# Altium schematic sheet DC_Power_Regulation.SchDoc
size A; SheetNumber: 1; SheetTotal: 2
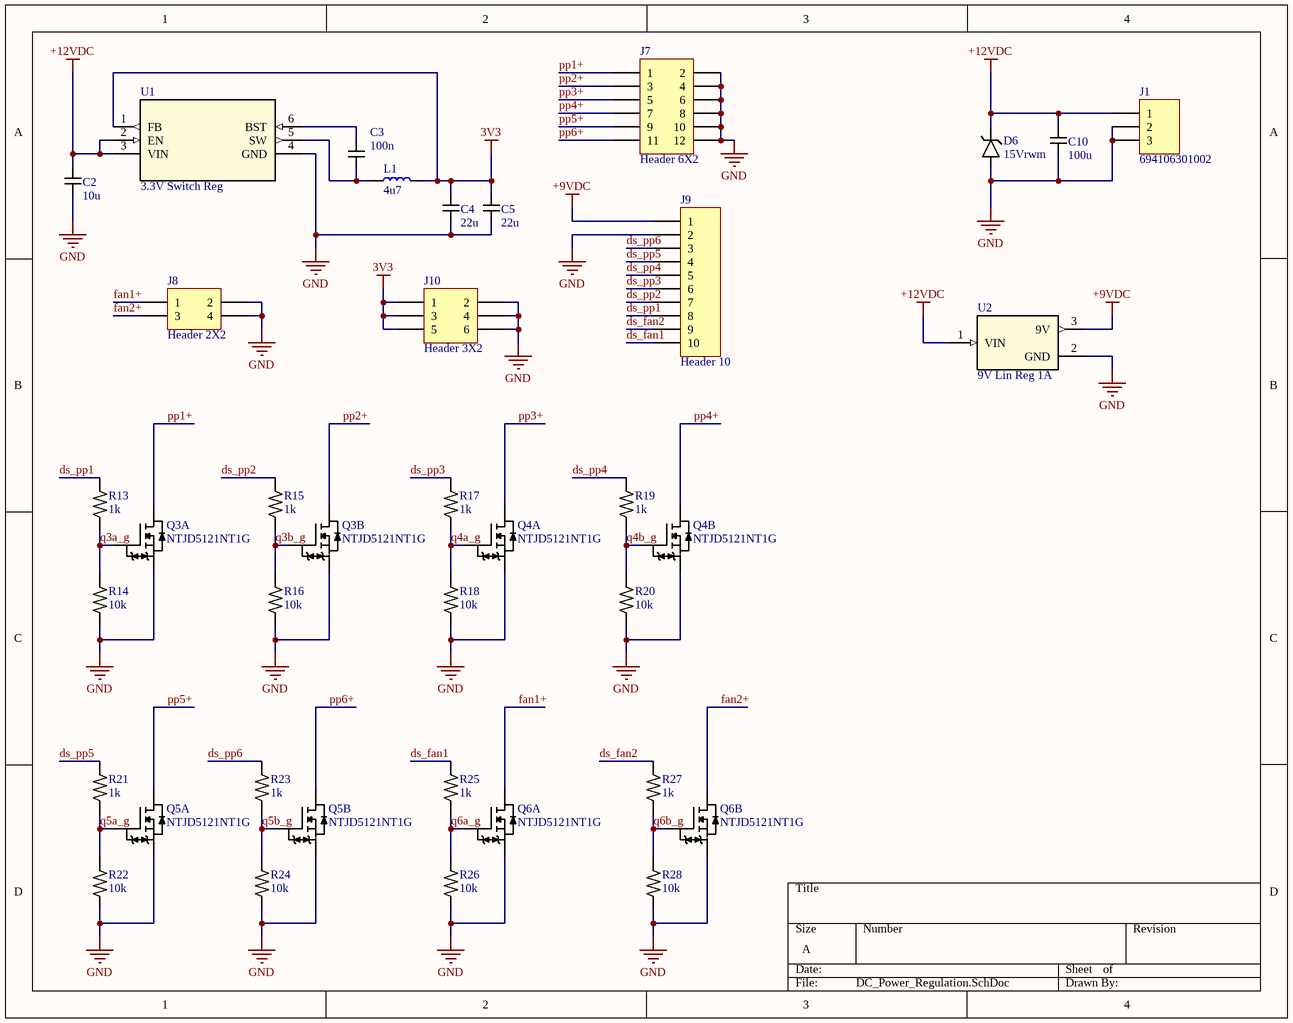
[diagram p0: DC_Power_Regulation.SchDoc]

## Parts
C2  10u  [CAP_0805]
C3  100n  [CAP_0402]
C4  22u  [CAP_0805]
C5  22u  [CAP_0805]
C10  100u  [CAP_EEH-ZA1V151P_PAN]
D6  15Vrwm  [SOD523]
J1  694106301002  [694106301002]
J7  Header 6X2  [HDR2X6]
J8  Header 2X2  [HDR2X2]
J9  Header 10  [HDR1X10]
J10  Header 3X2  [HDR2X3]
L1  4u7  [IND_0603]
Q3  NTJD5121NT1G  [SOT-363]  (parts A,B of 2)
Q4  NTJD5121NT1G  [SOT-363]  (parts A,B of 2)
Q5  NTJD5121NT1G  [SOT-363]  (parts A,B of 2)
Q6  NTJD5121NT1G  [SOT-363]  (parts A,B of 2)
R13  1k  [RES_0402]
R14  10k  [RES_0402]
R15  1k  [RES_0402]
R16  10k  [RES_0402]
R17  1k  [RES_0402]
R18  10k  [RES_0402]
R19  1k  [RES_0402]
R20  10k  [RES_0402]
R21  1k  [RES_0402]
R22  10k  [RES_0402]
R23  1k  [RES_0402]
R24  10k  [RES_0402]
R25  1k  [RES_0402]
R26  10k  [RES_0402]
R27  1k  [RES_0402]
R28  10k  [RES_0402]
U1  3.3V Switch Reg  [AP63203WU-7]
U2  9V Lin Reg 1A  [MC7809CTG]

## Nets
3V3: C4.2 C5.2 J10.1 J10.3 J10.5 L1.2 U1.1(FB)
+9VDC: J9.1 U2.3(9V)
+12VDC: C2.2 C10.2 D6.1(V++) J1.1 U1.2(EN) U1.3(VIN) U2.1(VIN)
GND: C2.1 C4.1 C5.1 C10.1 D6.2(GND) J1.2 J1.3 J7.2 J7.4 J7.6 J7.8 J7.10 J7.12 J8.2 J8.4 J9.2 J10.2 J10.4 J10.6 Q3.3(S1) Q3.6(S2) Q4.3(S1) Q4.6(S2) Q5.3(S1) Q5.6(S2) Q6.3(S1) Q6.6(S2) R14.1 R16.1 R18.1 R20.1 R22.1 R24.1 R26.1 R28.1 U1.4(GND) U2.2(GND)
ds_fan1: J9.10 R25.1
ds_fan2: J9.9 R27.1
ds_pp1: J9.8 R13.1
ds_pp2: J9.7 R15.1
ds_pp3: J9.6 R17.1
ds_pp4: J9.5 R19.1
ds_pp5: J9.4 R21.1
ds_pp6: J9.3 R23.1
fan1+: J8.1 Q6.1(D1)
fan2+: J8.3 Q6.4(D2)
pp1+: J7.1 Q3.1(D1)
pp2+: J7.3 Q3.4(D2)
pp3+: J7.5 Q4.1(D1)
pp4+: J7.7 Q4.4(D2)
pp5+: J7.9 Q5.1(D1)
pp6+: J7.11 Q5.4(D2)
q3a_g: Q3.2(G1) R13.2 R14.2
q3b_g: Q3.5(G2) R15.2 R16.2
q4a_g: Q4.2(G1) R17.2 R18.2
q4b_g: Q4.5(G2) R19.2 R20.2
q5a_g: Q5.2(G1) R21.2 R22.2
q5b_g: Q5.5(G2) R23.2 R24.2
q6a_g: Q6.2(G1) R25.2 R26.2
q6b_g: Q6.5(G2) R27.2 R28.2
NetC3_1: C3.1 L1.1 U1.5(SW)
NetC3_2: C3.2 U1.6(BST)

## Library data of the parts
C2 C4 C5 = CAP_0805
C3 = CAP_0402
C10 = CAP_EEH-ZA1V151P_PAN
D6 = PESD15VS1UB,115: ESD protection (TVS) diode in SOD523 package
J1 = Header 3: Header, 3-Pin; LatestRevisionDate: 17-Jul-2002; LatestRevisionNote: Re-released for DXP Platform.; Publisher: Altium Limited
J7 = Header 6X2: Header, 6-Pin, Dual row; LatestRevisionDate: 17-Jul-2002; LatestRevisionNote: Re-released for DXP Platform.; Publisher: Altium Limited
J8 = Header 2X2: Header, 2-Pin, Dual row; LatestRevisionDate: 17-Jul-2002; LatestRevisionNote: Re-released for DXP Platform.; Publisher: Altium Limited
J9 = Header 10: Header, 10-Pin; LatestRevisionDate: 17-Jul-2002; LatestRevisionNote: Re-released for DXP Platform.; Publisher: Altium Limited
J10 = Header 3X2: Header, 3-Pin, Dual row; LatestRevisionDate: 17-Jul-2002; LatestRevisionNote: Re-released for DXP Platform.; Publisher: Altium Limited
L1 = IND_0603: Inductor SMD 0603
Q3-Q6 = NTJD5121NT1G: 2 NMOSFETs SOT-363
R13-R28 = RES_0402: Resistor SMD 0402 (0.0625W)
U1 = AP63203WU-7: IC REG BUCK 3.3V 2A TSOT23-6
U2 = MC7809CTG: IC REG LINEAR 9V 1A TO220AB